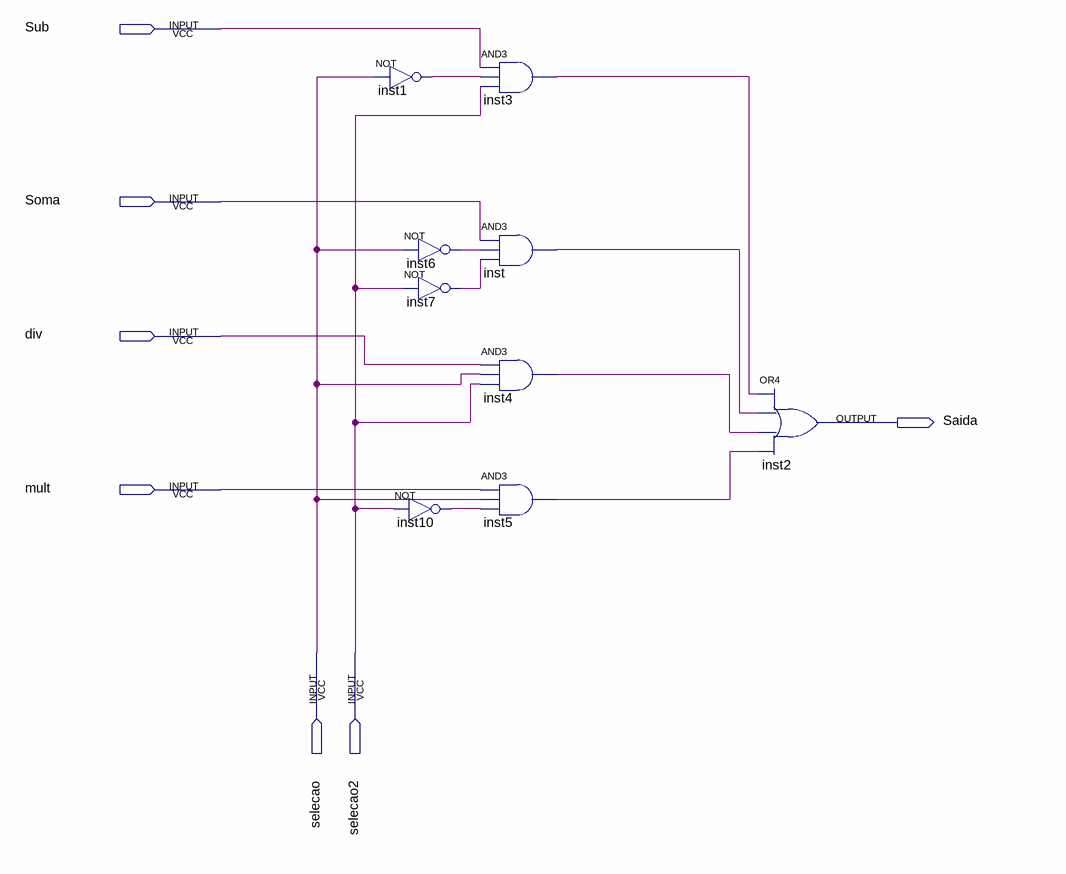
[diagram p0: schematic sheet]
// Quartus schematic Multiplex.bdf as structural Verilog: 9 symbols, 7 pins
module Multiplex (
  input  Sub,
  input  Soma,
  input  div,
  input  mult,
  input  selecao,
  input  selecao2,
  output Saida
);

  wire inst1_out, inst3_out, inst4_out, inst5_out, inst6_out, inst7_out, inst10_out, inst_out;

  not inst1 (inst1_out, selecao);
  not inst6 (inst6_out, selecao);
  not inst7 (inst7_out, selecao2);
  not inst10 (inst10_out, selecao2);
  and inst3 (inst3_out, Sub, inst1_out, selecao2);
  and inst (inst_out, Soma, inst6_out, inst7_out);
  and inst4 (inst4_out, div, selecao, selecao2);
  and inst5 (inst5_out, mult, selecao, inst10_out);
  or inst2 (Saida, inst3_out, inst_out, inst4_out, inst5_out);
endmodule
